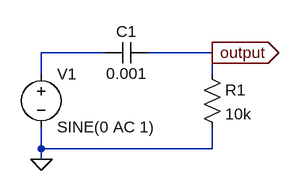
[diagram p0: schematic rc_highpass.asc]
rc_highpass.asc, the LTspice schematic file:
Version 4
SHEET 1 880 680
WIRE 256 80 160 80
WIRE 416 80 320 80
WIRE 160 112 160 80
WIRE 416 112 416 80
WIRE 160 224 160 192
WIRE 416 224 416 192
WIRE 416 224 160 224
WIRE 160 240 160 224
FLAG 160 240 0
FLAG 416 80 output
IOPIN 416 80 Out
SYMBOL voltage 160 96 R0
WINDOW 123 0 0 Left 0
WINDOW 39 0 0 Left 0
SYMATTR InstName V1
SYMATTR Value SINE(0 AC 1)
SYMBOL res 400 96 R0
SYMATTR InstName R1
SYMATTR Value 10k
SYMBOL cap 320 64 R90
WINDOW 0 0 32 VBottom 2
WINDOW 3 32 32 VTop 2
SYMATTR InstName C1
SYMATTR Value 0.001

The netlist it stands for:
* rc_highpass.asc
V1 N001 0 SINE(0 AC 1)
R1 output 0 10k
C1 output N001 0.001
.backanno
.end